# EAGLE design project_pcb (EAGLE 8.6.0)
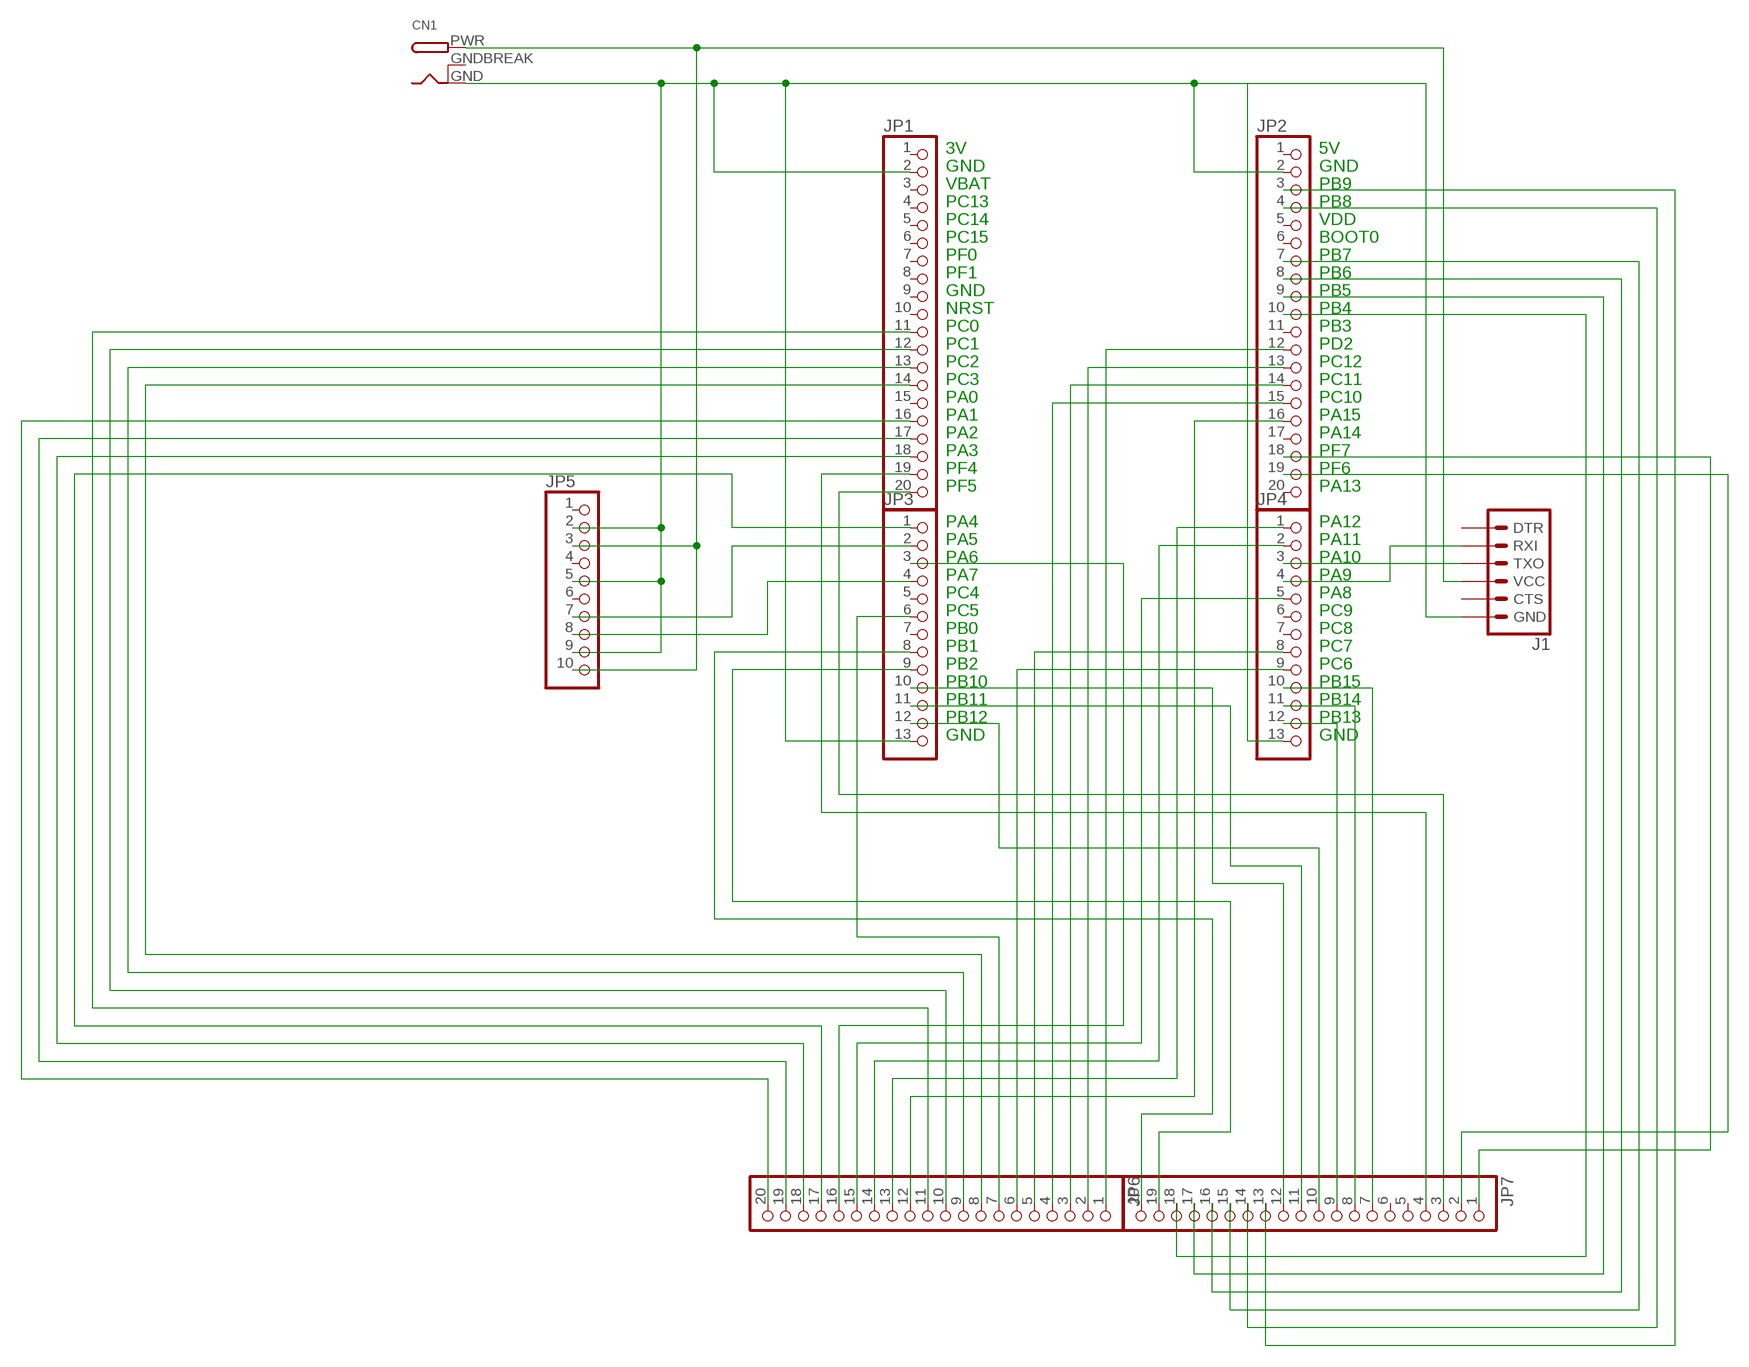
[diagram p0: schematic, sheet 1]

## Parts
CN1  DCBARRELPTH  [DCJACK_2MM_PTH]
J1  6_PIN_SERIAL_TARGET  [1X06]
JP1  PINHD-1X20  [1X20]
JP2  PINHD-1X20  [1X20]
JP3  PINHD-1X13  [1X13]
JP4  PINHD-1X13  [1X13]
JP5  PINHD-1X10  [1X10]
JP6  PINHD-1X20  [1X20]
JP7  PINHD-1X20  [1X20]

## Nets
N$1: J1.3(TXO) JP4.3
N$2: J1.2(RXI) JP4.4
N$3: CN1.PWR J1.4(VCC) JP5.3 JP5.10
N$4: CN1.GND J1.6(GND) JP1.2 JP2.2 JP3.13 JP4.13 JP5.2 JP5.5 JP5.9
N$5: JP3.2 JP5.7
N$6: JP3.4 JP5.8
N$7: JP1.16 JP6.20
N$8: JP1.17 JP6.19
N$9: JP1.18 JP6.18
N$10: JP3.1 JP6.17
N$11: JP3.3 JP6.16
N$12: JP4.5 JP6.15
N$13: JP4.2 JP6.14
N$14: JP4.1 JP6.13
N$15: JP2.16 JP6.12
N$16: JP1.11 JP6.11
N$17: JP1.12 JP6.10
N$18: JP1.13 JP6.9
N$19: JP1.14 JP6.8
N$20: JP3.6 JP6.7
N$21: JP4.9 JP6.6
N$22: JP4.8 JP6.5
N$23: JP2.15 JP6.4
N$24: JP2.14 JP6.3
N$25: JP2.13 JP6.2
N$26: JP2.10 JP7.18
N$27: JP3.8 JP7.20
N$28: JP3.9 JP7.19
N$29: JP2.9 JP7.17
N$30: JP2.8 JP7.16
N$31: JP2.7 JP7.15
N$32: JP2.4 JP7.14
N$33: JP2.3 JP7.13
N$34: JP3.10 JP7.12
N$35: JP3.11 JP7.11
N$36: JP3.12 JP7.10
N$37: JP4.12 JP7.9
N$38: JP4.11 JP7.8
N$39: JP4.10 JP7.7
N$40: JP2.18 JP7.1
N$41: JP2.19 JP7.2
N$42: JP1.20 JP7.3
N$43: JP1.19 JP7.4
N$44: JP2.12 JP6.1
Unconnected: J1.1(DTR) J1.5(CTS) JP1.1 JP1.3 JP1.4 JP1.5 JP1.6 JP1.7 JP1.8 JP1.9 JP1.10 JP1.15 JP2.1 JP2.5 JP2.6 JP2.11 JP2.17 JP2.20 JP3.5 JP3.7 JP4.6 JP4.7 JP5.1 JP5.4 JP5.6 JP7.5 JP7.6

## Notes on the sheet
- 3V | 5V
- GND | GND
- VBAT | PB9
- PC13 | PB8
- PC14 | VDD
- PC15 | BOOT0
- PF0 | PB7
- PF1 | PB6
- GND | PB5
- NRST | PB4
- PC0 | PB3
- PC1 | PD2
- PC2 | PC12
- PC3 | PC11
- PA0 | PC10
- PA1 | PA15
- PA2 | PA14
- PA3 | PF7
- PF4 | PF6
- PF5 | PA13
- PA4 | PA12
- PA5 | PA11
- PA6 | PA10
- PA7 | PA9
- PC4 | PA8
- PC5 | PC9
- PB0 | PC8
- PB1 | PC7
- PB2 | PC6
- PB10 | PB15
- PB11 | PB14
- PB12 | PB13
- GND | GND

## Power pins joined to a net without a drawn wire
GNDBREAK: CN1.GNDBREAK

## Library data of the parts
CN1 = adafruit:DCBARREL: 2.0mm DC Barrel Jack DCJACK_2MM_PTH - Through Hole Jack (4UConnector: 05537)
J1 = SparkFun-Connectors:6_PIN_SERIAL_TARGET: 6-pin header connection for use with the "FTDI BASIC" pinout - TARGET SIDE. Also known as "Arduino Serial Program Header". It is used to mate with our FTDI Basic serial programmers using the Arduino IDE. Note, this device has "TARGET" in the name. It is intended to be used on a design that contains a target micro-controller that you wish to program. The "sister" device, named "CABLE" is inteneded to be used on a design that usually lives on the end of your USB cable and prvides the converter chip (FTDI232 or FTDI231x) to commnicate serial RX/TX. You can populate with some of these: Break Away Headers - Straight <https://www.sparkfun.com/products/116> (PRT-00116) For reference (or to suit your programming needs) check out these designs: SparkFun FTDI Basic Breakout - 5V <https://www.sparkfun.com/products/9716> (DEV-09716) SparkFun FTDI Basic Breakout - 3.3V <https://www.sparkfun.com/products/9873> (DEV-09873) SparkFun FTDI SmartBasic <https://www.sparkfun.com/products/12935> (DEV-12935) SparkFun Beefy 3 - FTDI Basic Breakout <https://www.sparkfun.com/products/13746> (DEV-13746)
JP1 JP2 JP6 JP7 = pinhead:PINHD-1X20: PIN HEADER
JP3 JP4 = pinhead:PINHD-1X13: PIN HEADER
JP5 = pinhead:PINHD-1X10: PIN HEADER

## Board
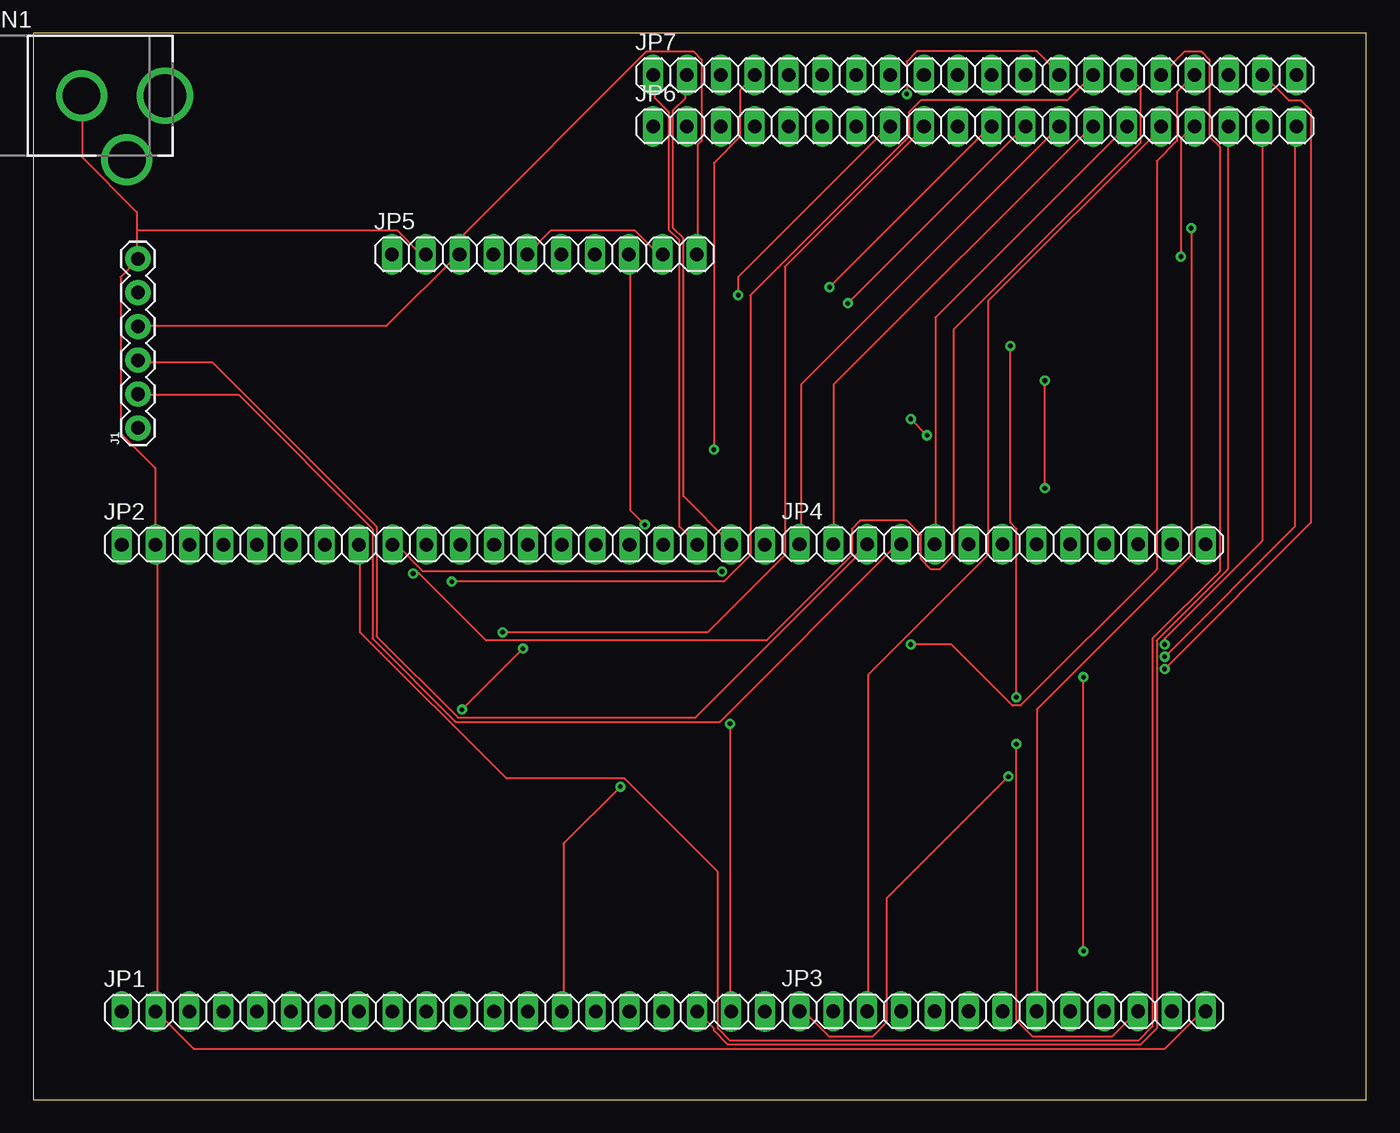
[diagram p1: board, top side]
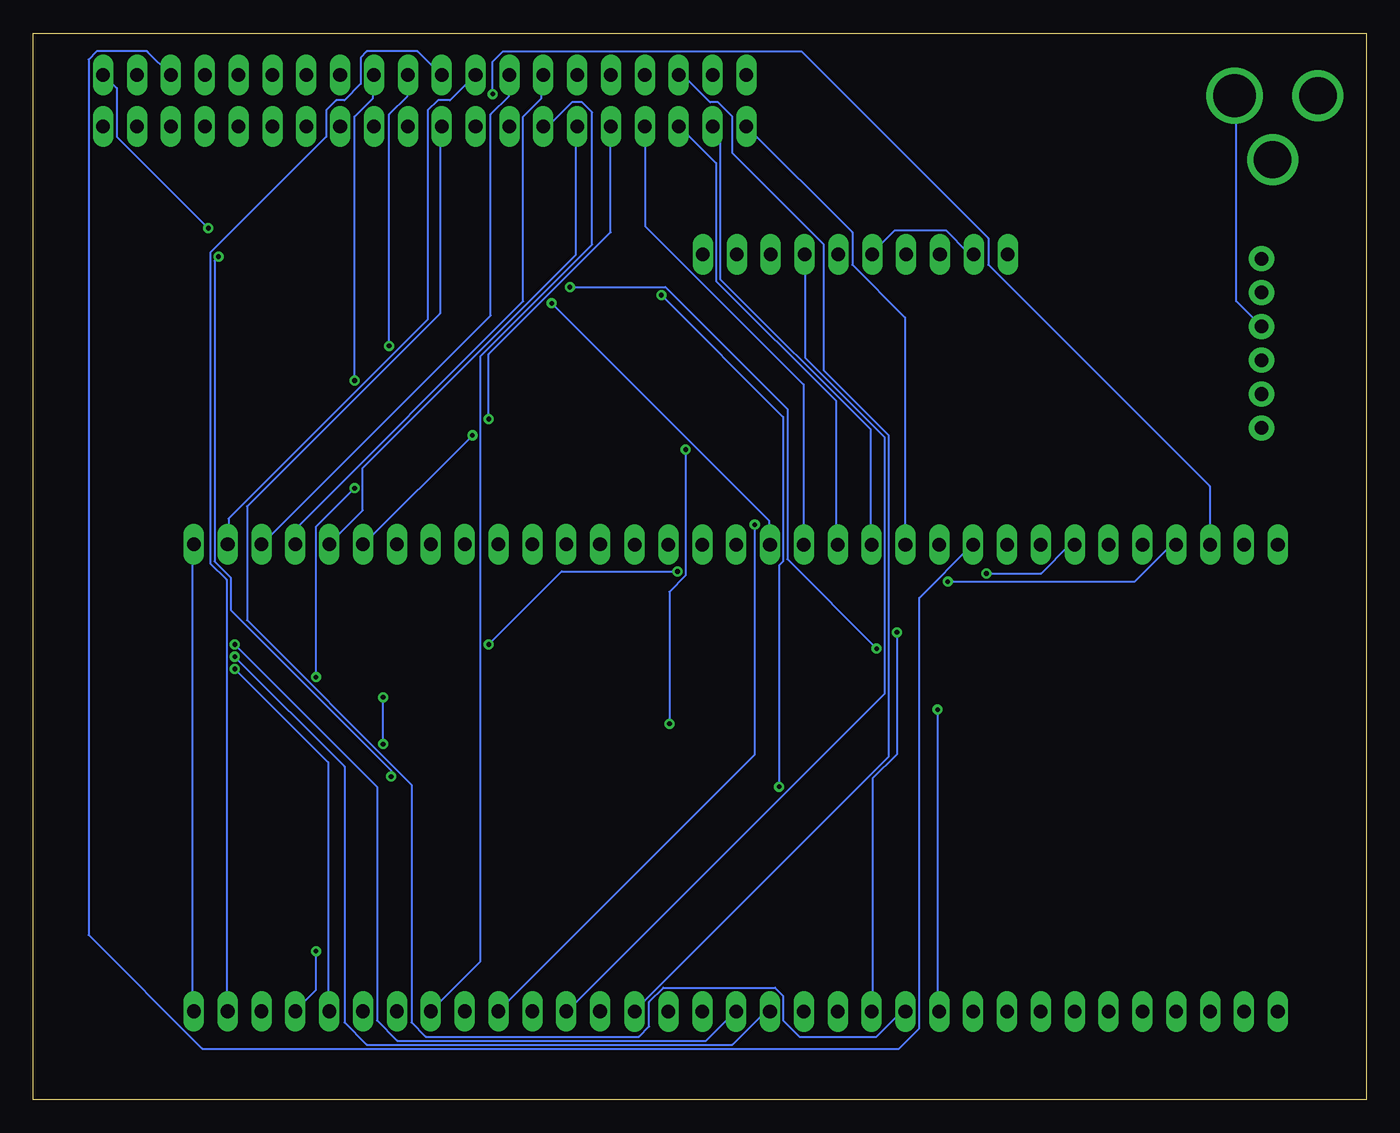
[diagram p2: board, bottom side, seen from below]

Size 100 x 80 mm. Coordinates in mm from the lower left corner, seen from the top.
Outline: 0,0 100,0 100,80 0,80 0,0
Copper layers (1*16): Top 0.035mm / dielectric 1.5mm / Bottom 0.035mm
Design rules "default": minimum track width 6mil, minimum drill 0.35mm, track to track 6mil, track to pad 6mil, pad to pad 6mil, via to via 6mil, smd to smd 6mil, copper to edge 40mil, drill to drill 6mil, minimum pad ring 10mil, minimum via ring 8mil, stop-mask expansion 4mil, vias tented up to drill 0mil, thermal gap 10mil

### Footprints (pad centres in the part's own frame; a part is rotated, then mirrored left to right if it is on the bottom)
DCJACK_2MM_PTH = drill 2.8: GND 0,7.35; GNDBREAK 4.8,10.75 | drill 3.2: PWR 0,13.6
1X06 = drill 1.016 pad 1.88: 1 0,0; 2 2.54,0; 3 5.08,0; 4 7.62,0; 5 10.16,0; 6 12.7,0
1X20 = drill 1.016 long: 1 -24.13,0; 2 -21.59,0; 3 -19.05,0; 4 -16.51,0; 5 -13.97,0; 6 -11.43,0; 7 -8.89,0; 8 -6.35,0; 9 -3.81,0; 10 -1.27,0; 11 1.27,0; 12 3.81,0; 13 6.35,0; 14 8.89,0; 15 11.43,0; 16 13.97,0; 17 16.51,0; 18 19.05,0; 19 21.59,0; 20 24.13,0
1X13 = drill 1.016 long: 1 -15.24,0; 2 -12.7,0; 3 -10.16,0; 4 -7.62,0; 5 -5.08,0; 6 -2.54,0; 7 0,0; 8 2.54,0; 9 5.08,0; 10 7.62,0; 11 10.16,0; 12 12.7,0; 13 15.24,0
1X10 = drill 1.016 long: 1 -11.43,0; 2 -8.89,0; 3 -6.35,0; 4 -3.81,0; 5 -1.27,0; 6 1.27,0; 7 3.81,0; 8 6.35,0; 9 8.89,0; 10 11.43,0

### Placement (x,y rotation side)
CN1  -3.73,75.32 270 top
J1  7.85,50.39 90 top
JP1  30.76,6.59 0 top
JP2  30.76,41.64 0 top
JP3  72.72,6.62 0 top
JP4  72.72,41.67 0 top
JP5  38.33,63.42 0 top
JP6  70.63,73.02 0 top
JP7  70.63,76.87 0 top

### Tracks (layer width: path | path; a pad name or v marks a point on that pad's centre or on a via)
N$1
  Top 0.152: JP4.3 62.48,41.6 61.72,40.84 61.72,40.69 49.68,28.65 31.85,28.65 25.76,34.75 25.76,42.98 13.41,55.32 7.92,55.32 J1.3
N$2
  Top 0.152: JP4.4 65.08,41.6 64.77,41.6 51.51,28.35 31.7,28.35 25.45,34.59 25.45,42.82 15.39,52.88 7.92,52.88 J1.2
N$3
  Top 0.152: J1.4 7.92,58.06 26.52,58.06 31.85,63.4 JP5.3 32,63.55 32,64.62 46.02,78.64 49.53,78.64 50.14,78.03 50.14,71.93 49.84,71.63 49.84,63.55 JP5.10
  Bottom 0.152: CN1.PWR 9.75,75.29 9.75,59.89 7.92,58.06 J1.4
N$4
  Top 0.152: JP5.9 47.09,63.55 46.79,63.55 45.11,65.23 38.86,65.23 37.19,63.55 JP5.5 | 7.77,65.23 7.77,66.6 3.66,70.71 3.66,75.29 CN1.GND | 7.77,65.23 7.77,63.09 J1.6 7.77,62.94 6.55,61.72 6.55,49.99 9.14,47.4 9.14,41.76 JP2.2 9.3,41.6 9.3,6.71 JP1.2 9.3,6.55 12.04,3.81 84.89,3.81 87.63,6.55 87.94,6.55 JP3.13 | 7.77,65.23 27.28,65.23 28.96,63.55 29.41,63.55 JP5.2
  Bottom 0.152: JP3.13 88.09,6.71 88.09,41.6 JP4.13 | JP5.2 29.57,63.55 29.87,63.55 31.55,65.23 35.36,65.23 37.03,63.55 JP5.5
N$5
  Bottom 0.152: JP5.7 42.06,63.4 42.06,55.63 36.12,49.68 36.12,30.48 59.89,6.71 JP3.2
N$6  (via drill 0.35)
  Top 0.152: v45.87,43.13 44.81,44.2 44.81,63.4 JP5.8
  Bottom 0.152: v45.87,43.13 45.87,25.91 65.08,6.71 JP3.4
N$7  (via drill 0.35)
  Top 0.152: v84.89,33.22 94.64,42.98 94.64,73 JP6.20
  Bottom 0.152: v84.89,33.22 76.66,24.99 76.66,5.79 74.98,4.12 47.55,4.12 45.11,6.55 44.81,6.55 JP1.16
N$8  (via drill 0.35)
  Top 0.152: v84.89,34.14 84.89,34.59 92.2,41.91 92.2,73 JP6.19
  Bottom 0.152: v84.89,34.14 74.22,23.47 74.22,5.94 72.69,4.42 49.53,4.42 47.4,6.55 JP1.17
N$9
  Top 0.152: JP1.18 49.84,6.55 51.05,5.33 51.05,5.18 52.12,4.12 83.06,4.12 84.28,5.33 84.28,34.44 89.61,39.78 89.61,73 JP6.18
N$10  (via drill 0.35)
  Top 0.152: v73.15,24.23 64.01,15.09 64.01,5.79 62.94,4.72 59.74,4.72 57.91,6.55 57.61,6.55 JP3.1 | v86.11,63.25 86.11,72.08 87.02,73 JP6.17
  Bottom 0.152: v73.15,24.23 73.15,24.69 85.19,36.73 85.19,39.17 86.41,40.39 86.41,62.94 v86.11,63.25
N$11
  Top 0.152: JP3.3 62.64,6.71 62.64,31.85 71.63,40.84 71.63,59.89 84.73,73 JP6.16
N$12
  Top 0.152: JP4.5 67.67,41.76 67.67,58.67 81.99,73 JP6.15
N$13
  Top 0.152: JP4.2 60.05,41.76 60.05,53.65 79.4,73 JP6.14
N$14
  Top 0.152: JP4.1 57.61,41.76 57.61,53.65 76.96,73 JP6.13
N$15  (via drill 0.35)
  Top 0.152: v61.11,59.74 74.37,73 JP6.12
  Bottom 0.152: v61.11,59.74 44.81,43.43 44.81,41.76 JP2.16
N$16  (via drill 0.35)
  Top 0.152: v36.73,33.83 v32.16,29.26 | v59.74,60.96 71.78,73 JP6.11
  Bottom 0.152: v32.16,29.26 32.16,6.71 JP1.11 | v36.73,33.83 43.43,40.54 43.43,51.82 52.58,60.96 v59.74,60.96
N$17
  Bottom 0.152: JP1.12 34.59,6.55 34.9,6.55 36.73,4.72 42.52,4.72 43.74,5.94 43.74,7.77 44.35,8.38 52.73,8.38 53.8,7.32 53.8,5.49 54.56,4.72 70.56,4.72 71.63,5.79 71.63,23.62 83.97,35.97 83.97,44.5 69.49,58.98 69.49,73 JP6.10
N$18  (via drill 0.35)
  Top 0.152: v35.2,35.05 50.6,35.05 56.39,40.84 56.39,62.48 66.9,73 JP6.9
  Bottom 0.152: v35.2,35.05 35.2,25.91 37.03,24.08 37.03,6.71 JP1.13
N$19  (via drill 0.35)
  Top 0.152: v44.04,23.47 39.78,19.2 39.78,6.71 JP1.14 | v52.88,60.35 52.88,61.72 64.16,73 JP6.8
  Bottom 0.152: v44.04,23.47 44.04,40.08 43.74,40.39 43.74,51.21 v52.88,60.35
N$20
  Bottom 0.152: JP6.7 61.72,73.15 61.27,73.15 59.59,74.83 58.83,74.83 58.06,74.07 58.06,64.16 66.45,55.78 66.45,10.36 70.1,6.71 JP3.6
N$21
  Bottom 0.152: JP6.6 59.28,73 59.28,63.4 75.29,47.4 75.29,44.2 77.72,41.76 JP4.9
N$22  (via drill 0.35)
  Top 0.152: v67.06,49.84 v65.84,51.05
  Bottom 0.152: v65.84,51.05 65.84,55.93 56.69,65.08 56.69,73 JP6.5 | v67.06,49.84 75.13,41.76 JP4.8
N$23
  Bottom 0.152: JP2.15 42.22,41.76 42.22,53.65 54.1,65.53 54.1,73 JP6.4
N$24
  Bottom 0.152: JP2.14 39.78,41.76 39.78,52.43 48.77,61.42 48.77,70.26 51.51,73 JP6.3
N$25
  Bottom 0.152: JP2.13 37.19,41.76 37.19,50.29 48.46,61.57 48.46,72.54 48.92,73 JP6.2
N$26
  Bottom 0.152: 91.4,78.6 89.76,76.96 JP7.18 | 91.4,78.6 91.44,78.64 95.25,78.64 95.86,78.03 95.86,12.34 87.33,3.81 35.05,3.81 33.53,5.33 33.53,37.64 29.57,41.6 JP2.10 | 91.4,78.6
N$27  (via drill 0.35)
  Top 0.152: v86.87,65.38 86.87,40.84 75.29,29.26 75.29,6.71 JP3.8
  Bottom 0.152: v86.87,65.38 93.73,72.24 93.73,75.89 94.64,76.81 JP7.20
N$28  (via drill 0.35)
  Top 0.152: v84.89,32.31 95.86,43.28 95.86,74.22 95.1,74.98 94.18,74.98 92.35,76.81 JP7.19
  Bottom 0.152: v84.89,32.31 77.88,25.3 77.88,6.71 JP3.9
N$29  (via drill 0.35)
  Top 0.152: v51.66,39.62 29.26,39.62 27.28,41.6 26.98,41.6 JP2.9 | v65.84,34.14 68.89,34.14 73.46,29.57 74.07,29.57 84.28,39.78 84.28,70.41 85.8,71.93 85.8,75.59 87.02,76.81 JP7.17
  Bottom 0.152: v51.66,39.62 60.35,39.62 v65.84,34.14
N$30
  Top 0.152: JP2.8 24.54,41.6 24.54,35.05 35.51,24.08 44.35,24.08 51.36,17.07 51.36,5.33 52.27,4.42 82.91,4.42 83.97,5.49 83.97,34.59 89,39.62 89,71.48 88.24,72.24 88.24,78.03 87.63,78.64 86.41,78.64 84.73,76.96 JP7.16
N$31  (via drill 0.35)
  Top 0.152: v28.5,39.47 28.96,39.47 33.98,34.44 55.02,34.44 61.42,40.84 61.42,42.82 62.03,43.43 65.53,43.43 66.6,42.37 66.6,40.54 67.36,39.78 67.97,39.78 69.04,40.84 69.04,57.76 83.06,71.78 83.06,75.89 82.14,76.81 JP7.15
  Bottom 0.152: v28.5,39.47 24.38,39.47 22.25,41.6 21.95,41.6 JP2.7
N$32  (via drill 0.35)
  Top 0.152: v31.39,38.86 51.82,38.86 53.8,40.84 53.8,60.35 65.68,72.24 65.68,74.07 66.6,74.98 77.57,74.98 79.4,76.81 JP7.14
  Bottom 0.152: v31.39,38.86 17.37,38.86 14.63,41.6 14.33,41.6 JP2.4
N$33  (via drill 0.35)
  Top 0.152: v65.53,75.44 65.53,77.88 66.29,78.64 75.29,78.64 76.96,76.96 JP7.13
  Bottom 0.152: v65.53,75.44 65.53,77.88 64.77,78.64 42.37,78.64 28.35,64.62 28.35,62.64 11.73,46.02 11.73,41.76 JP2.3
N$34  (via drill 0.35)
  Top 0.152: v75.89,45.87 v75.89,53.95 | v78.79,11.12 v78.79,31.7
  Bottom 0.152: v75.89,53.95 75.89,73.76 74.52,75.13 74.52,76.81 JP7.12 | v75.89,45.87 78.79,42.98 v78.79,31.7 | v78.79,11.12 78.79,8.23 80.31,6.71 JP3.10
N$35  (via drill 0.35)
  Top 0.152: v73.3,56.54 73.3,43.28 73.76,42.82 v73.76,30.18 | v73.76,26.67 73.76,5.94 74.98,4.72 80.92,4.72 82.75,6.55 JP3.11
  Bottom 0.152: v73.3,56.54 73.3,73.91 71.93,75.29 71.93,76.81 JP7.11 | v73.76,26.67 v73.76,30.18
N$36
  Bottom 0.152: JP3.12 85.5,6.71 85.5,39.01 86.72,40.23 86.72,63.55 78.03,72.24 78.03,74.22 77.27,74.98 76.66,74.98 75.44,76.2 75.44,78.18 74.98,78.64 71.17,78.64 69.49,76.96 JP7.10
N$37
  Bottom 0.152: JP4.12 85.34,41.76 85.34,43.59 70.41,58.52 70.41,74.22 69.65,74.98 68.73,74.98 66.9,76.81 JP7.9
N$38
  Bottom 0.152: JP7.8 64.31,76.81 64.31,75.29 65.68,73.91 65.68,58.83 82.75,41.76 JP4.11
N$39
  Bottom 0.152: JP7.7 61.87,76.81 61.87,75.13 63.25,73.76 63.25,59.89 80.31,42.82 80.31,41.76 JP4.10
N$40
  Top 0.152: JP7.1 46.63,76.81 46.63,75.13 47.7,74.07 47.7,65.23 48.46,64.47 48.46,42.98 49.68,41.76 JP2.18
N$41
  Top 0.152: JP7.2 48.92,76.81 48.92,75.13 48.01,74.22 48.01,65.38 48.77,64.62 48.77,45.26 52.27,41.76 JP2.19
N$42
  Bottom 0.152: JP7.3 51.51,76.81 51.21,76.81 49.23,74.83 48.62,74.83 47.55,73.76 47.55,71.02 40.69,64.16 40.69,54.71 35.81,49.84 35.81,25.76 54.86,6.71 JP1.20
N$43  (via drill 0.35)
  Top 0.152: v52.27,28.19 52.27,6.71 JP1.19 | v51.05,48.77 51.05,70.26 53.03,72.24 53.03,75.74 54.1,76.81 JP7.4
  Bottom 0.152: v52.27,28.19 52.27,38.1 51.05,39.32 v51.05,48.77
N$44
  Bottom 0.152: JP2.12 34.59,41.76 34.59,58.67 38.56,62.64 38.56,65.08 46.48,73 JP6.1